# EAGLE design ir_beacon (EAGLE 9.1.1)
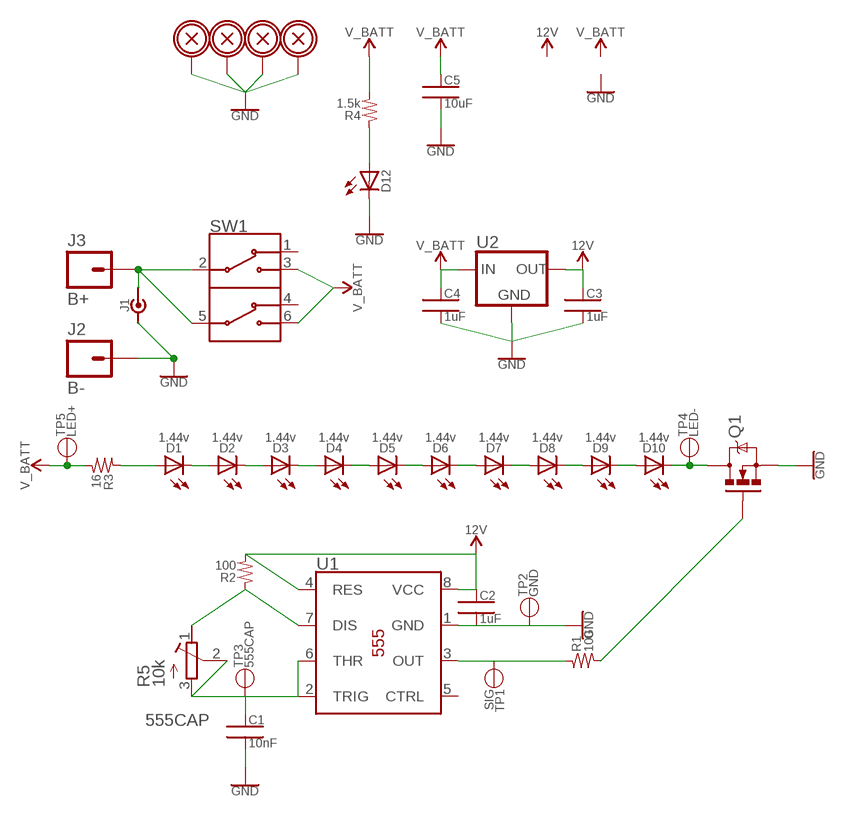
[diagram p0: schematic, sheet 1]

## Parts
C1  10nF  CAP_PTH_SMALL_.1"  [CAP-PTH-.1"]
C2  1uF  CAP_SMD_0805  [0805]
C3  1uF  CAP_SMD_0805  [0805]
C4  1uF  CAP_SMD_0805  [0805]
C5  10uF  CAP_SMD_0805  [0805]
D1  1.44v  LED_PLCC-2  [PLCC-2]
D2  1.44v  LED_PLCC-2  [PLCC-2]
D3  1.44v  LED_PLCC-2  [PLCC-2]
D4  1.44v  LED_PLCC-2  [PLCC-2]
D5  1.44v  LED_PLCC-2  [PLCC-2]
D6  1.44v  LED_PLCC-2  [PLCC-2]
D7  1.44v  LED_PLCC-2  [PLCC-2]
D8  1.44v  LED_PLCC-2  [PLCC-2]
D9  1.44v  LED_PLCC-2  [PLCC-2]
D10  1.44v  LED_PLCC-2  [PLCC-2]
D12  LED1206  [LED-1206]
H1  BOLTHOLE_M3  [M3_HOLE]
H2  BOLTHOLE_M3  [M3_HOLE]
H3  BOLTHOLE_M3  [M3_HOLE]
H4  BOLTHOLE_M3  [M3_HOLE]
J1  PJ-082BH  [PJ-082BH]
J2  B-  14AWG_PTH  [14AWG_PTH]
J3  B+  14AWG_PTH  [14AWG_PTH]
Q1  MOSFET_N-CHANNEL_DPAK  [DPAK]
R1  100  RES_SMD_0805  [0805]
R2  100  RES_SMD_0805  [0805]
R3  16  RES_SMD_1206  [1206]
R4  1.5k  RES_SMD_0805  [0805]
R5  10k  3296W  [3296W]
SW1  CNK-L202_MS02  [CNK-L202XXXMS02XXX]
TP1  SIG  TESTPOINT_A  [1X01]
TP2  GND  TESTPOINT_A  [1X01]
TP3  555CAP  TESTPOINT_A  [1X01]
TP4  LED-  TESTPOINT_A  [1X01]
TP5  LED+  TESTPOINT_A  [1X01]
U1  555_TIMER_DIP8  [DIL08]
U2  78XX_VREG_DPAK  [DPAK]

## Nets
12V: C2.1 C3.1 R2.2 U1.4(RES) U1.8(VCC) U2.3(OUT)
555CAP: C1.1 R5.2(S) R5.3(A) TP3.1(TP) U1.2(TRIG) U1.6(THR)
B+: J1.1 J3.P SW1.2(I1) SW1.5(I2)
GND: C1.2 C2.2 C3.2 C4.2 C5.2 D12.C H1.P H2.P H3.P H4.P J1.2 J1.SH1 J1.SH2 J1.SH3 J1.SH4 J2.P Q1.3(S) TP2.1(TP) U1.1(GND) U2.4(GND)
N$1: D1.A R3.1
N$2: D1.C D2.A
N$3: D2.C D3.A
N$4: D3.C D4.A
N$5: D4.C D5.A
N$6: D5.C D6.A
N$7: D6.C D7.A
N$8: D7.C D8.A
N$9: D8.C D9.A
N$10: D9.C D10.A
N$11: D10.C Q1.4(D) TP4.1(TP)
N$13: D12.A R4.1
N$16: R1.1 TP1.1(TP) U1.3(OUT)
N$18: Q1.1(G) R1.2
N$20: R2.1 R5.1(E) U1.7(DIS)
V_BATT: C4.1 C5.1 R3.2 R4.2 SW1.3(O1B) SW1.6(O2B) TP5.1(TP) U2.1(IN)
Unconnected: SW1.1(O1A) SW1.4(O2A) U1.5(CTRL)

## Library data of the parts
C1 = jack_RCL:CAP_PTH
C2-C5 = jack_RCL:CAP_SMD
D1-D10 D12 = jack_led:LED
H1-H4 = jack_mechanical:BOLTHOLE
J1 = jack_connector:PJ-082BH: 2.5mm X 5.5mm Barrel Jack 10A https://www.mouser.com/productdetail/cui/pj-082bh?qs=sGAEpiMZZMtnOp%252bbbqA009lE0K0K%252bPZGlcfi0IIywdBXw6pUdVh2jw%3D%3D
J2 J3 = jack_connector:14AWG
Q1 = jack_semi:MOSFET_N-CHANNEL
R1-R4 = jack_RCL:RES_SMD
R5 = jack_RCL:3296: Bourns Trimpot 3296
SW1 = jack_electromechanical:CNK-L202
TP1-TP5 = meltylib:TESTPOINT: A simple test point with multiple ways to tap off a signal
U1 = jack_IC:555_TIMER
U2 = jack_IC:78XX_VREG: Generic IGO 78XX linear voltage regulator

## Board
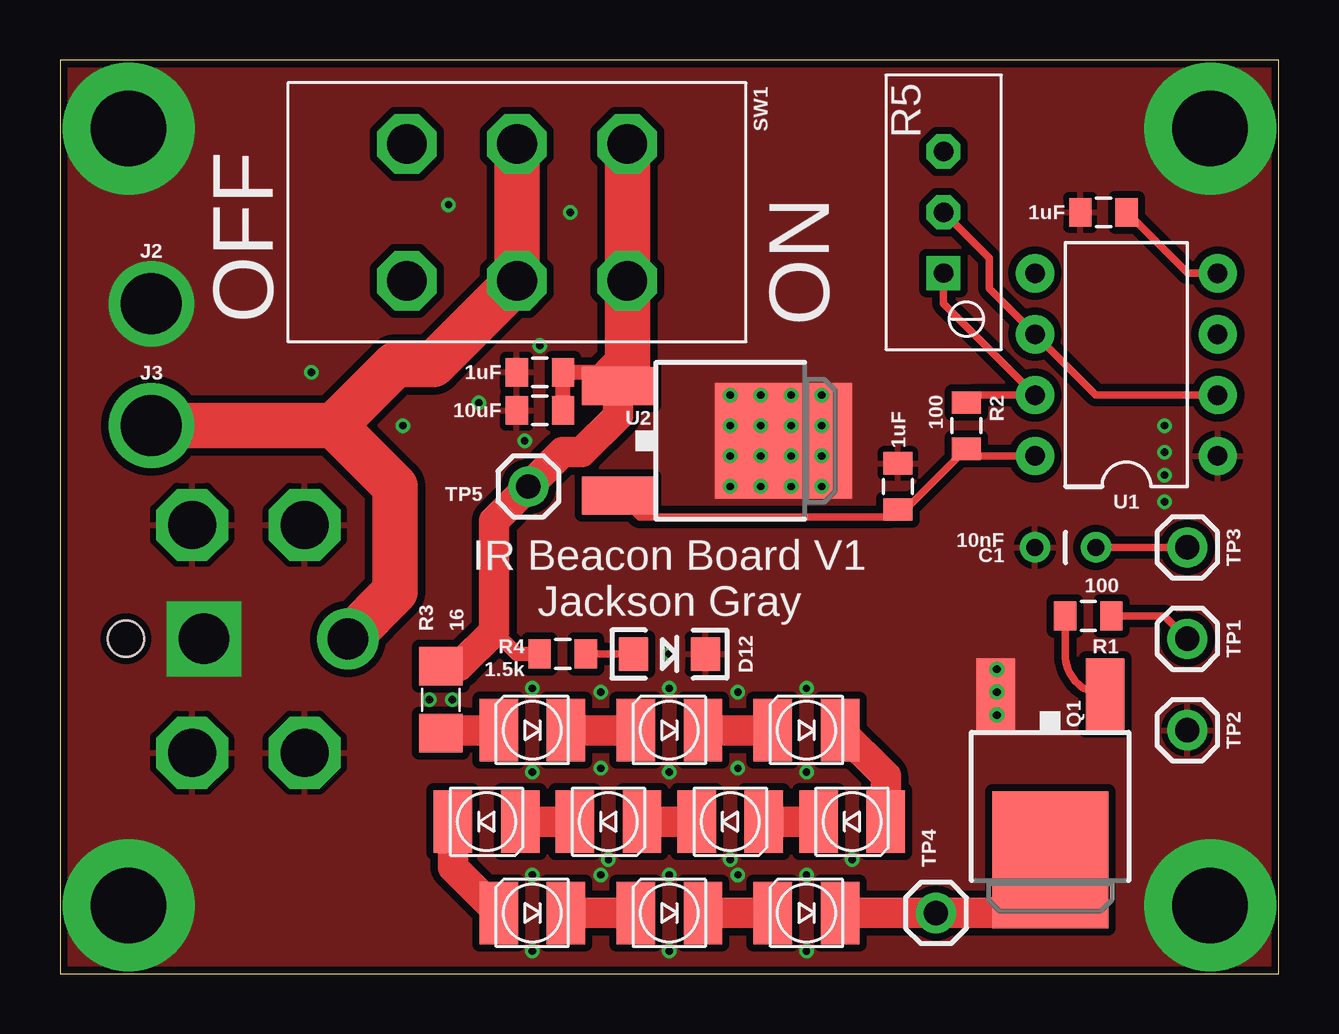
[diagram p1: board, top side]
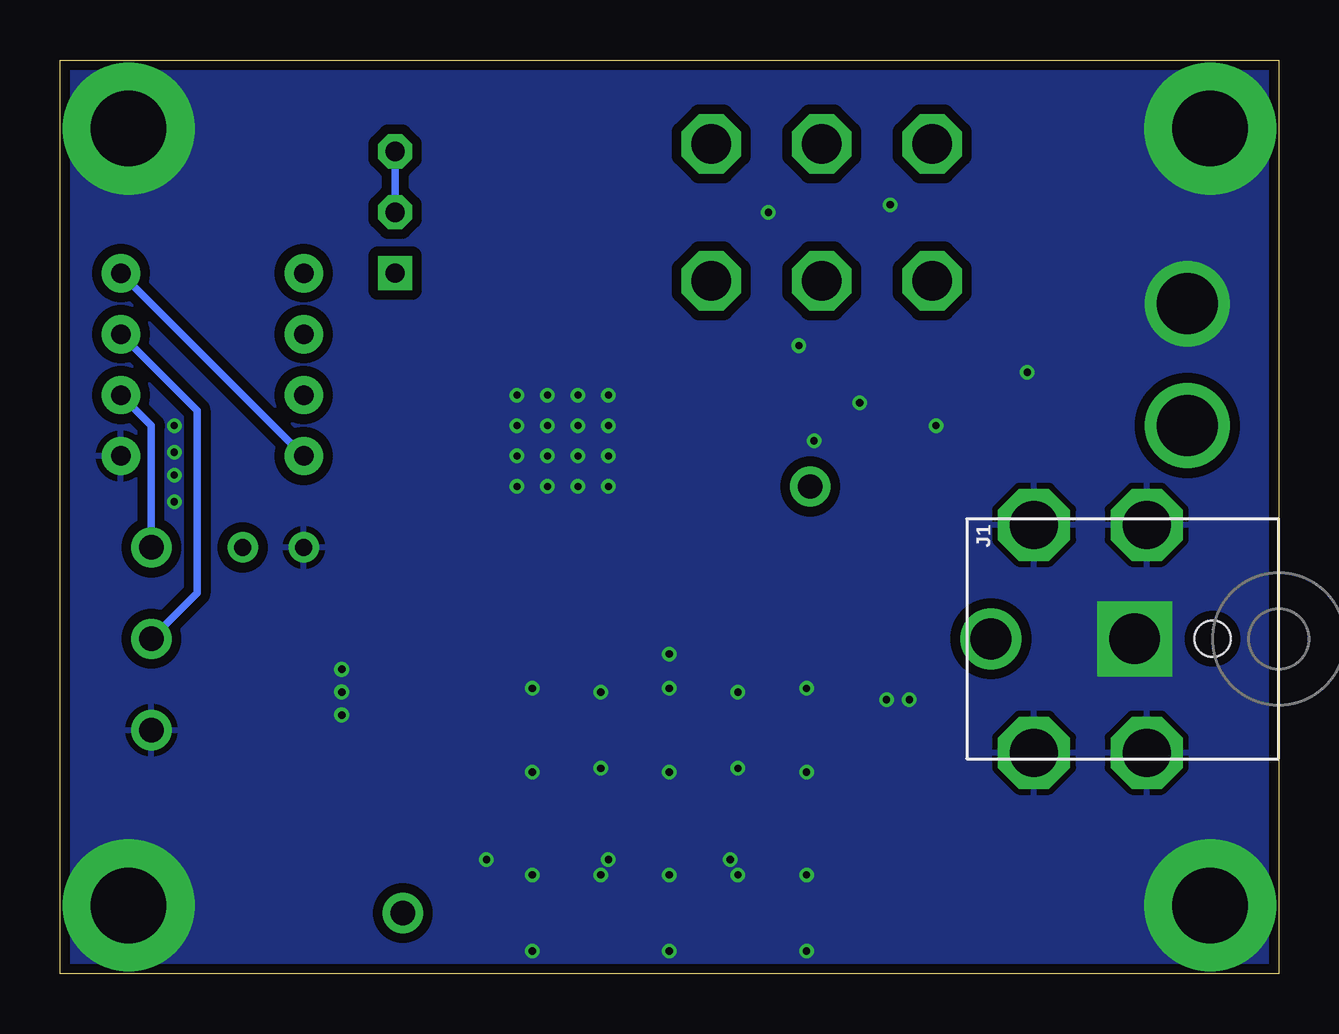
[diagram p2: board, bottom side, seen from below]

Size 50.8 x 38.1 mm. Coordinates in mm from the lower left corner, seen from the top.
Outline: 0,0 50.8,0 50.8,38.1 0,38.1 0,0
Copper layers (1*16): Top 0.035mm / dielectric 1.5mm / Bottom 0.035mm
Design rules "3PCB_2layer": minimum track width 6mil, minimum drill 0.3mm, track to track 6mil, track to pad 6mil, pad to pad 6mil, via to via 6mil, smd to smd 0mil, copper to edge 6mil, drill to drill 6mil, minimum pad ring 6mil, minimum via ring 6mil, stop-mask expansion 2mil, vias tented up to drill 0.3mm, thermal gap 10mil

### Footprints (pad centres in the part's own frame; a part is rotated, then mirrored left to right if it is on the bottom)
CAP-PTH-.1" = drill 0.7 pad 1.27: 1 -1.27,0; 2 1.27,0
0805 = smd 0.927 x 1.2: 1 -0.964,0; 2 0.964,0
PLCC-2 = smd 1.6 x 2.6: A -1.4,0; C 1.4,0
LED-1206 = smd 1.2 x 1.4: A -1.5,0; C 1.5,0
M3_HOLE = drill 3.15 pad 5.5: P 0,0
PJ-082BH = drill 1.7: 1 12,0 | drill 2.1 square: 2 6,0 | drill 2 octagon: SH1 5.5,4.75; SH2 10.2,4.75; SH3 5.5,-4.75; SH4 10.2,-4.75 | hole 1.5: 2.75,0
14AWG_PTH = drill 2.54: P 0,0
DPAK = smd 1.6 x 3: 1 -2.28,-5.31; 3 2.28,-5.31 | smd 4.826 x 5.715: 4 0,1.588
1206 = smd 1.6 x 1.8: 1 -1.4,0; 2 1.4,0
3296W = drill 0.8 pad 1.422 square: 1 0,-2.54 | drill 0.8 pad 1.422 octagon: 2 0,0; 3 0,2.54
CNK-L202XXXMS02XXX = drill 1.651 octagon: 1 -2.857,-4.597; 2 -2.857,0; 3 -2.857,4.597; 4 2.857,-4.597; 5 2.857,0; 6 2.857,4.597
1X01 = drill 1.016 pad 1.676: 1 0,0
DIL08 = drill 0.813 pad 1.6: 1 -3.81,-3.81; 2 -1.27,-3.81; 3 1.27,-3.81; 4 3.81,-3.81; 5 3.81,3.81; 6 1.27,3.81; 7 -1.27,3.81; 8 -3.81,3.81

### Placement (x,y rotation side)
C1  41.91,17.78 180 top
C2  34.92,20.32 90 top
C3  43.5,31.75 180 top
C4  20,25.08 180 top
C5  20,23.5 180 top
D1  19.68,10.16 0 top
D2  25.4,10.16 0 top
D3  31.11,10.16 0 top
D4  33.02,6.35 180 top
D5  27.94,6.35 180 top
D6  22.86,6.35 180 top
D7  17.78,6.35 180 top
D8  19.68,2.54 0 top
D9  25.4,2.54 0 top
D10  31.11,2.54 0 top
D12  25.4,13.34 0 top
H1  2.86,35.24 0 top
H2  2.86,2.86 0 top
H3  47.94,2.86 0 top
H4  47.94,35.24 0 top
J1  0,13.97 180 bottom
J2  3.81,27.94 0 top
J3  3.81,22.86 0 top
Q1  41.27,6.35 180 top
R1  42.86,14.92 180 top
R2  37.78,22.86 270 top
R3  15.88,11.43 90 top
R4  20.95,13.34 180 top
R5  36.83,31.75 0 top
SW1  19.05,31.75 270 top
TP1  46.99,13.97 0 top
TP2  46.99,10.16 0 top
TP3  46.99,17.78 0 top
TP4  36.51,2.54 90 top
TP5  19.53,20.32 180 top
U1  44.45,25.4 90 top
U2  28.57,22.23 270 top

### Tracks (layer width: path | path; a pad name or v marks a point on that pad's centre or on a via)
12V
  Top 0.318: C3.1 47,29.21 U1.4 | U2.3 24.16,19.05 34.62,19.05 C2.1 35.24,19.36 R2.2 38.09,21.59 U1.8
  Bottom 0.318: U1.4 U1.8
555CAP
  Top 0.318: TP3.1 C1.1 | R5.2 38.73,29.84 38.73,28.57 U1.6 43.18,24.13 U1.2
  Bottom 0.318: TP3.1 46.99,22.86 U1.2 | R5.3 R5.2
B+
  Top 1.905: J3.P 11.43,22.86 | 11.43,22.86 13.97,20.32 13.97,15.94 J1.1 | SW1.2 SW1.5 15.56,25.4 13.97,25.4 11.43,22.86
GND  (via drill 0.3, 0.32)
  other vias: 27.94,24.13 27.94,22.86 27.94,21.59 27.94,20.32 29.21,20.32 29.21,21.59 29.21,22.86 29.21,24.13 30.48,24.13 31.75,24.13 31.75,22.86 31.75,21.59 31.75,20.32 30.48,20.32 30.48,21.59 30.48,22.86 39.05,12.7 39.05,11.75 39.05,10.79 19.37,22.23 20,26.19 21.27,31.75 16.19,32.07 10.48,25.08 14.29,22.86 17.46,23.81 22.54,8.57 22.54,11.75 28.26,11.75 28.26,8.57 22.54,4.13 28.26,4.13 19.68,8.41 25.4,8.41 31.11,8.41 31.11,11.91 25.4,11.91 19.68,11.91 27.94,4.76 22.86,4.76 19.68,0.95 25.4,0.95 25.4,4.13 19.68,4.13 31.11,4.13 31.11,0.95 33.02,4.76 25.4,13.34 15.4,11.43 16.35,11.43 46.04,22.86 46.04,21.75 46.04,20.8 46.04,19.68
  pour Top (isolate 0.305): -1.27,-1.27 -1.27,39.37 52.07,39.37 52.07,-1.27
  pour Bottom (isolate 0.406): -2.54,-2.54 -2.54,40.64 53.34,40.64 53.34,-2.54
N$1
  Top 1.27: D1.A 16,10.16 R3.1
N$2
  Top 1.27: D1.C D2.A
N$3
  Top 1.27: D2.C D3.A
N$4
  Top 1.27: D3.C 34.42,8.26 D4.A
N$5
  Top 1.27: D4.C D5.A
N$6
  Top 1.27: D5.C D6.A
N$7
  Top 1.27: D6.C D7.A
N$8
  Top 1.27: D8.A 16.38,4.45 D7.C
N$9
  Top 1.27: D8.C D9.A
N$10
  Top 1.27: D9.C D10.A
N$11
  Top 1.27: D10.C TP4.1 39.05,2.54 Q1.4
N$13
  Top 0.318: R4.1 D12.A
N$16
  Top 0.318: R1.1 46.04,14.92 TP1.1
  Bottom 0.318: U1.3 45.09,23.5 45.09,15.88 TP1.1
N$18
  Top 0.318: R1.2 41.9,13.32 arc90 Q1.1
N$20
  Top 0.318: R2.1 38.09,24.13 U1.7 36.83,27.94 R5.1
V_BATT
  Top 0.61: R4.2 19.05,13.34 18.1,14.29
  Top 0.635: 23.32,25.08 C4.1 C5.1 | 23,24.77 U2.1
  Top 1.27: R3.2 16.64,12.83 18.1,14.29 18.1,18.89 TP5.1 20.95,21.75 21.75,21.75 23.27,23.27 U2.1
  Top 1.905: SW1.3 SW1.6 23.65,25.41 23.32,25.08 23.16,24.92 23,24.77

### Text on the board
tPlace: OFF | ON | IR Beacon Board V1 / Jackson Gray